# EAGLE design IceCream interface board (EAGLE 6.6.0)
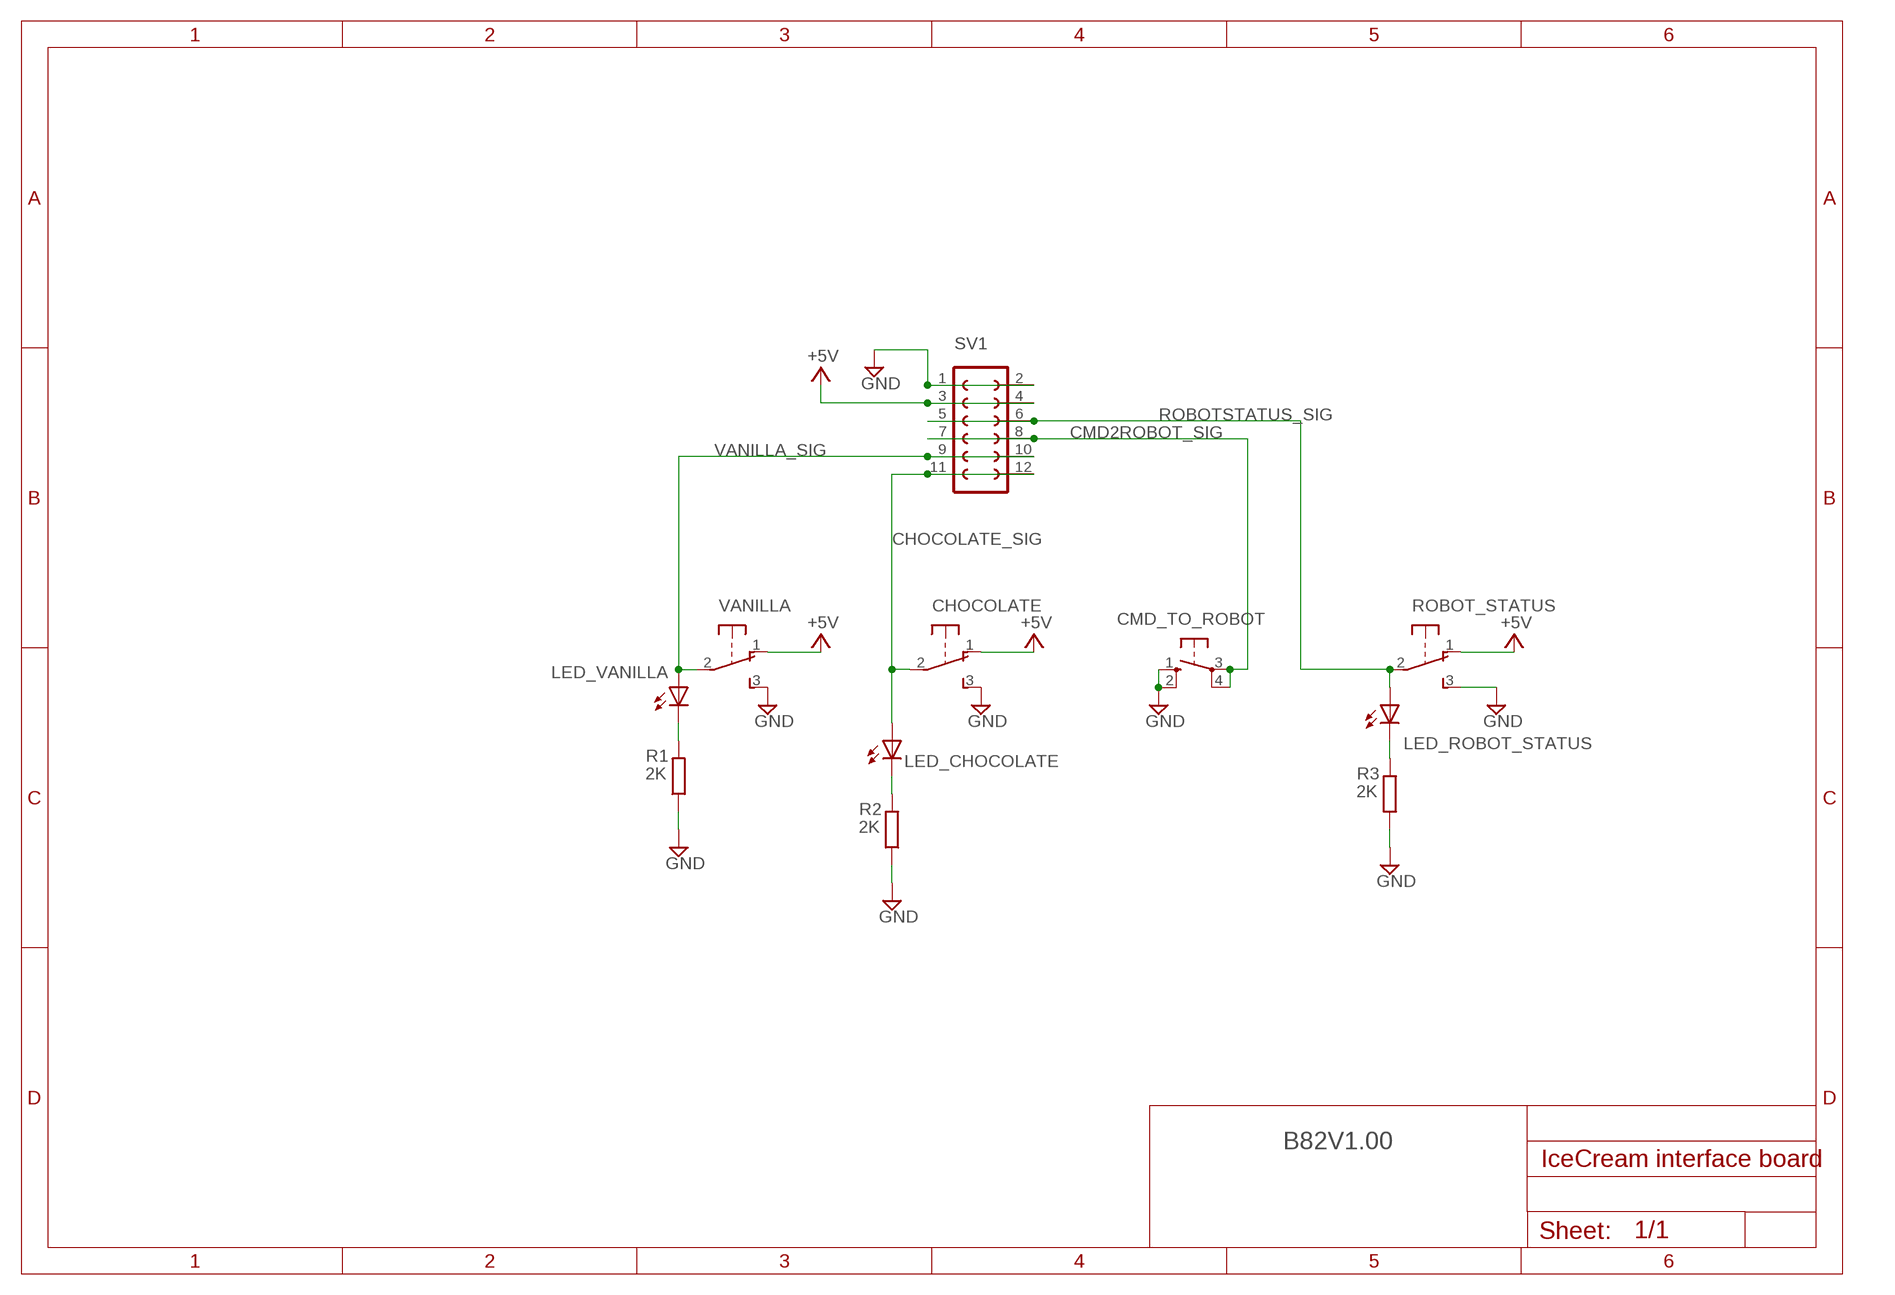
[diagram p0: schematic, sheet 1]

## Parts
CHOCOLATE  TOGGLE_SW  [MA03-1]
CMD_TO_ROBOT  TACT_SWITCH  [B3F-10XX]
LED_CHOCOLATE  LED5MM  [LED5MM]
LED_ROBOT_STATUS  LED5MM  [LED5MM]
LED_VANILLA  LED5MM  [LED5MM]
R1  2K  R-EU_0207/10  [0207/10]
R2  2K  R-EU_0207/10  [0207/10]
R3  2K  R-EU_0207/10  [0207/10]
ROBOT_STATUS  TOGGLE_SW  [MA03-1]
SV1  FE06-2  [FE06-2]
VANILLA  TOGGLE_SW  [MA03-1]

## Nets
+5V: CHOCOLATE.1(O) ROBOT_STATUS.1(O) SV1.3 SV1.4 VANILLA.1(O)
CHOCOLATE_SIG: CHOCOLATE.2(P) LED_CHOCOLATE.A SV1.11 SV1.12
CMD2ROBOT_SIG: CMD_TO_ROBOT.3(P) CMD_TO_ROBOT.4(P1) SV1.7 SV1.8
GND: CHOCOLATE.3(S) CMD_TO_ROBOT.1(S) CMD_TO_ROBOT.2(S1) R1.1 R2.1 R3.1 ROBOT_STATUS.3(S) SV1.1 SV1.2 VANILLA.3(S)
N$3: LED_VANILLA.K(C) R1.2
N$4: LED_CHOCOLATE.K(C) R2.2
N$8: LED_ROBOT_STATUS.K(C) R3.2
ROBOTSTATUS_SIG: LED_ROBOT_STATUS.A ROBOT_STATUS.2(P) SV1.5 SV1.6
VANILLA_SIG: LED_VANILLA.A SV1.9 SV1.10 VANILLA.2(P)

## Notes on the sheet
- B82V1.00

## Library data of the parts
CHOCOLATE ROBOT_STATUS VANILLA = simon:TOGGLE_SW: Toggle switch with MA03-1 package
CMD_TO_ROBOT = Passive:TACT_SWITCH: OMRON SWITCH 10-XX series
LED_CHOCOLATE LED_ROBOT_STATUS LED_VANILLA = led:LED: LED OSRAM: - CHIPLED LG R971, LG N971, LY N971, LG Q971, LY Q971, LO R971, LY R971 LH N974, LH R974 LS Q976, LO Q976, LY Q976 LO Q996 - Hyper CHIPLED LW Q18S LB Q993, LB Q99A, LB R99A - SideLED LS A670, LO A670, LY A670, LG A670, LP A670 LB A673, LV A673, LT A673, LW A673 LH A674 LY A675 LS A676, LA A676, LO A676, LY A676, LW A676 LS A679, LY A679, LG A679 - Hyper Micro SIDELED® LS Y876, LA Y876, LO Y876, LY Y876 LT Y87S - SmartLED LW L88C, LW L88S LB L89C, LB L89S, LG L890 LS L89K, LO L89K, LY L89K LS L896, LA L896, LO L896, LY L896 - TOPLED LS T670, LO T670, LY T670, LG T670, LP T670 LSG T670, LSP T670, LSY T670, LOP T670, LYG T670 LG T671, LOG T671, LSG T671 LB T673, LV T673, LT T673, LW T673 LH T674 LS T676, LA T676, LO T676, LY T676, LB T676, LH T676, LSB T676, LW T676 LB T67C, LV T67C, LT T67C, LS T67K, LO T67K, LY T67K, LW E67C LS E67B, LA E67B, LO E67B, LY E67B, LB E67C, LV E67C, LT E67C LW T67C LS T679, LY T679, LG T679 LS T770, LO T770, LY T770, LG T770, LP T770 LB T773, LV T773, LT T773, LW T773 LH T774 LS E675, LA E675, LY E675, LS T675 LS T776, LA T776, LO T776, LY T776, LB T776 LHGB T686 LT T68C, LB T68C - Hyper Mini TOPLED® LB M676 - Mini TOPLED Santana® LG M470 LS M47K, LO M47K, LY M47K Source: http://www.osram.convergy.de LUXEON: - LUMILED® LXK2-PW12-R00, LXK2-PW12-S00, LXK2-PW14-U00, LXK2-PW14-V00 LXK2-PM12-R00, LXK2-PM12-S00, LXK2-PM14-U00 LXK2-PE12-Q00, LXK2-PE12-R00, LXK2-PE12-S00, LXK2-PE14-T00, LXK2-PE14-U00 LXK2-PB12-K00, LXK2-PB12-L00, LXK2-PB12-M00, LXK2-PB14-N00, LXK2-PB14-P00, LXK2-PB14-Q00 LXK2-PR12-L00, LXK2-PR12-M00, LXK2-PR14-Q00, LXK2-PR14-R00 LXK2-PD12-Q00, LXK2-PD12-R00, LXK2-PD12-S00 LXK2-PH12-R00, LXK2-PH12-S00 LXK2-PL12-P00, LXK2-PL12-Q00, LXK2-PL12-R00 Source: www.luxeon.com KINGBRIGHT: KA-3528ASYC Source: www.kingbright.com
R1-R3 = resistor:R-EU_: RESISTOR, European symbol
SV1 = con-lsta:FE06-2: FEMALE HEADER; OC_FARNELL: unknown; OC_NEWARK: unknown

## Board
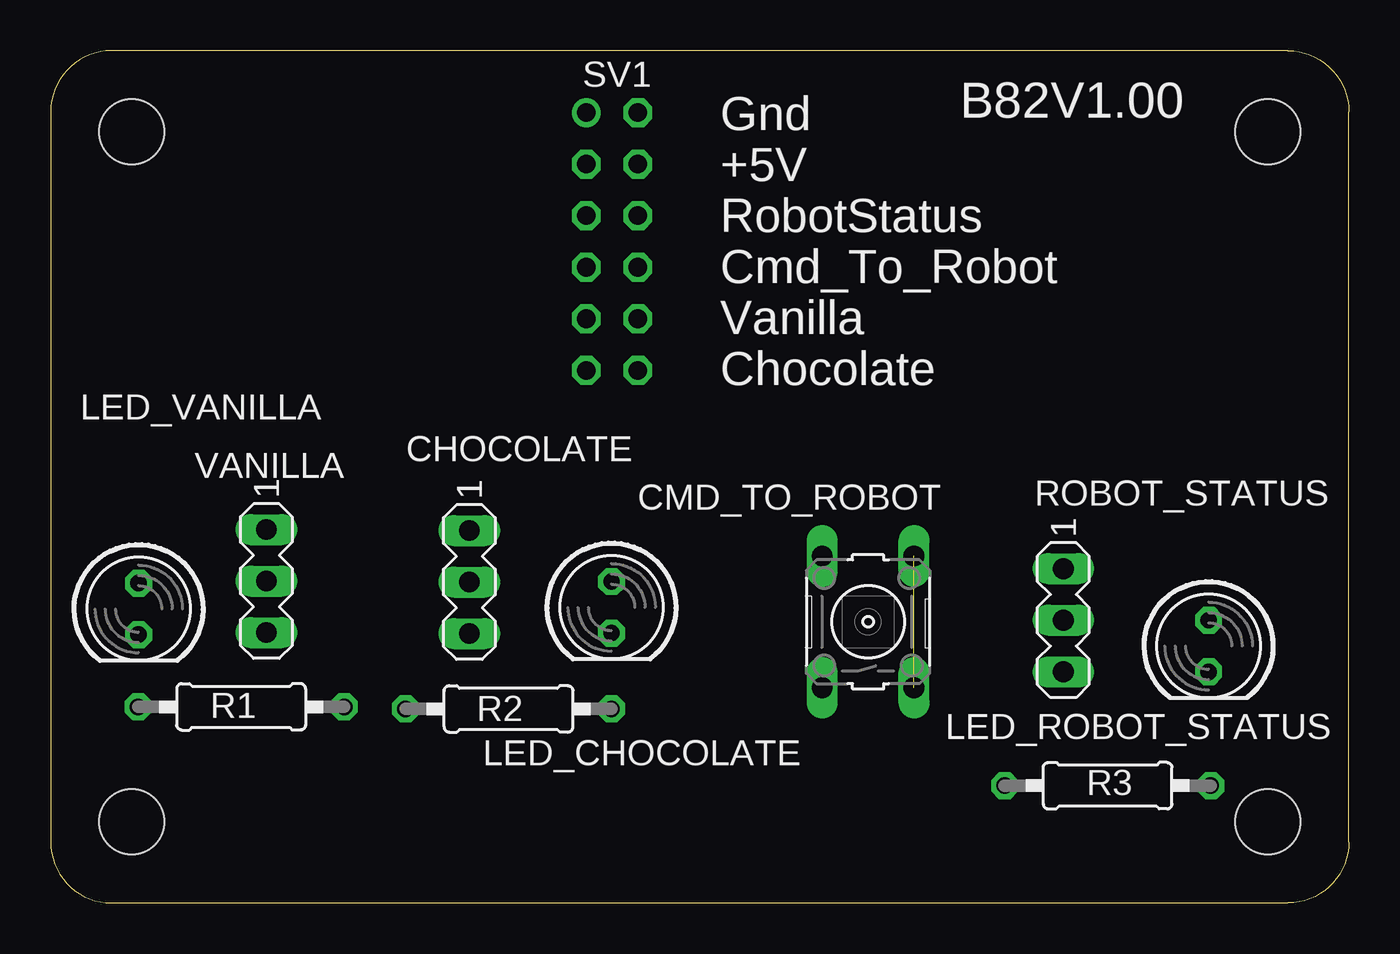
[diagram p1: board, top side]
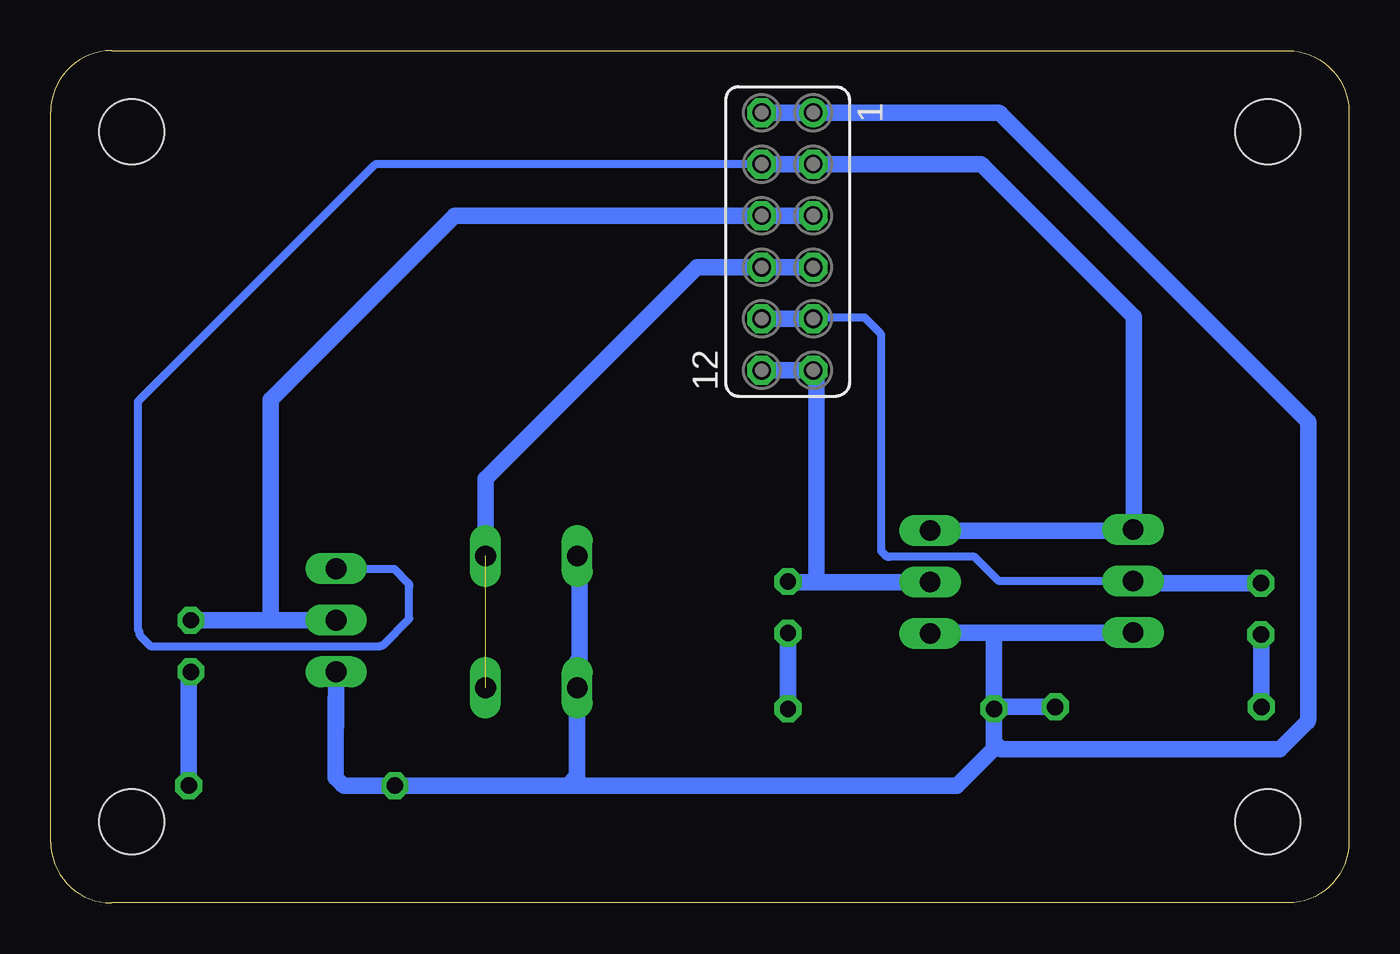
[diagram p2: board, bottom side, seen from below]

Size 64 x 42 mm. Coordinates in mm from the lower left corner, seen from the top.
Outline: 3,0 61,0 arc90 64,3 64,39 arc90 61,42 3,42 arc90 0,39 0,3 arc90 3,0
Copper layers (1*16): Top 0.035mm / dielectric 1.5mm / Bottom 0.035mm
Design rules "default *": minimum track width 10mil, minimum drill 24mil, track to track 8mil, track to pad 8mil, pad to pad 8mil, via to via 8mil, smd to smd 8mil, copper to edge 40mil, drill to drill 8mil, minimum pad ring 10mil, minimum via ring 8mil, stop-mask expansion 4mil, vias tented up to drill 0mil, thermal gap 10mil
Holes 3.2 mm at 4,4 4,38 60,4 60,38

### Footprints (pad centres in the part's own frame; a part is rotated, then mirrored left to right if it is on the bottom)
MA03-1 = drill 1.016 long: 1 -2.54,0; 2 0,0; 3 2.54,0
B3F-10XX = drill 1.016 long: 1 -3.251,2.261; 2 3.251,2.261; 3 -3.251,-2.261; 4 3.251,-2.261
LED5MM = drill 0.813 octagon: A -1.27,0; K 1.27,0
0207/10 = drill 0.813 octagon: 1 -5.08,0; 2 5.08,0
FE06-2 = drill 0.914: 1 -6.35,1.27 | drill 0.914 octagon: 2 -6.35,-1.27; 3 -3.81,1.27; 4 -3.81,-1.27; 5 -1.27,1.27; 6 -1.27,-1.27; 7 1.27,1.27; 8 1.27,-1.27; 9 3.81,1.27; 10 3.81,-1.27; 11 6.35,1.27; 12 6.35,-1.27

### Placement (x,y rotation side)
CHOCOLATE  20.64,15.81 270 top
CMD_TO_ROBOT  40.3,13.85 90 top
LED_CHOCOLATE  27.65,14.57 270 top
LED_ROBOT_STATUS  57.09,12.66 270 top
LED_VANILLA  4.33,14.49 270 top
R1  9.39,9.66 180 top
R2  22.57,9.56 0 top
R3  52.11,5.78 0 top
ROBOT_STATUS  49.93,13.93 270 top
SV1  27.68,32.6 270 bottom
VANILLA  10.63,15.86 270 top

### Tracks (layer width: path | path; a pad name or v marks a point on that pad's centre or on a via)
+5V
  Bottom 0.406: SV1.4 47.89,36.41 arc-45 48.07,36.34 59.7,24.7 59.7,13.55 arc-45 59.63,13.37 59.63,13.33 arc-45 59.56,13.15 59.07,12.66 47.77,12.66 arc-45 47.59,12.73 46.32,14.01 46.32,15.6 arc-45 46.39,15.78 47.06,16.45 49.87,16.45 arc45 ROBOT_STATUS.1
  Bottom 0.61: 10.68,18.35 VANILLA.1
  Bottom 0.813: CHOCOLATE.1 10.68,18.35 | SV1.4 SV1.3 18.23,36.41 arc45 18.05,36.34 10.61,28.89 10.61,18.46 arc45 VANILLA.1
CHOCOLATE_SIG
  Bottom 0.813: CHOCOLATE.2 26.43,15.81 | 26.43,15.81 27.62,15.81 LED_CHOCOLATE.A | 26.43,15.81 26.25,15.99 26.25,26.12 26.38,26.25 SV1.11 SV1.12
CMD2ROBOT_SIG  (1 unrouted)
  Bottom 0.813: SV1.7 SV1.8 32.15,31.33 42.56,20.92 CMD_TO_ROBOT.4
GND
  Bottom 0.61: 20.59,13.32 CHOCOLATE.3
  Bottom 0.813: 17.59,13.32 VANILLA.3 10.51,13.19 | 17.59,13.32 20.59,13.32 | SV1.1 SV1.2 17.34,38.95 arc45 17.16,38.88 2.01,23.72 2.01,9.07 arc45 2.08,8.89 3.4,7.57 17.05,7.57 arc45 17.23,7.64 17.49,7.9 | ROBOT_STATUS.3 49.93,10.13 | 49.93,10.13 49.93,8.67 | R2.1 17.49,13.22 17.59,13.32 | R1.1 17.39,9.66 R2.1 | 38.5,5.78 R3.1 49.46,5.78 arc45 49.64,5.85 49.96,6.17 49.96,10.05 arc45 49.93,10.13 | 38.5,5.78 19.32,5.78 17.49,7.61 17.49,7.9 | 17.49,7.9 R2.1 | 38.5,5.78 38.04,6.23 CMD_TO_ROBOT.1 38.04,11.87 37.94,11.97 37.94,17 CMD_TO_ROBOT.2
N$3
  Bottom 0.813: R1.2 4.31,13.19 LED_VANILLA.K
N$4
  Bottom 0.813: R2.2 LED_CHOCOLATE.K
N$8
  Bottom 0.813: R3.2 57.19,11.29 LED_ROBOT_STATUS.K
ROBOTSTATUS_SIG
  Bottom 0.813: SV1.5 SV1.6 44.08,33.87 53.15,24.8 53.15,14.13 53.35,13.93 | ROBOT_STATUS.2 53.35,13.93 | 53.35,13.93 LED_ROBOT_STATUS.A
VANILLA_SIG
  Bottom 0.406: VANILLA.2 17.16,15.86 arc45 17.34,15.94 18.46,17.05 22.67,17.05 arc45 22.85,17.13 23.05,17.33 23.05,27.92 arc-45 23.13,28.1 23.87,28.84 26.28,28.84 arc-45 SV1.9
  Bottom 0.813: VANILLA.2 10.53,15.76 LED_VANILLA.A 4.36,15.79 | SV1.9 SV1.10

### Text on the board
tNames: B82V1.00 | Gnd / +5V / RobotStatus / Cmd_To_Robot / Vanilla / Chocolate